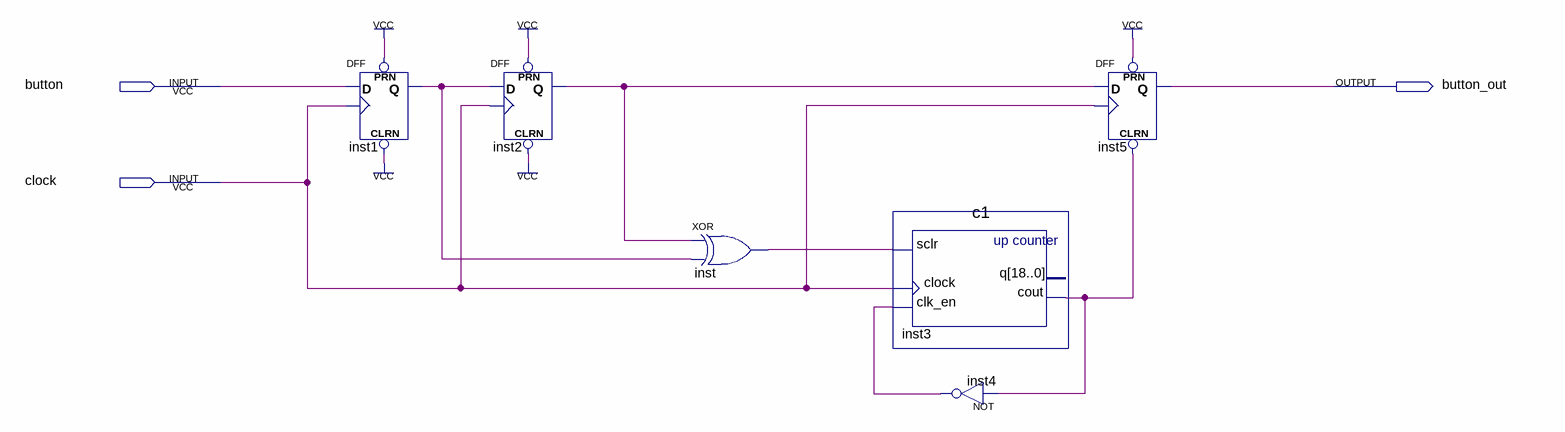
[diagram p0: schematic sheet]
// Quartus schematic Debouncer.bdf as structural Verilog: 6 symbols, 3 pins
module Debouncer (
  input  button,
  input  clock,
  output button_out
);

  wire inst1_q, inst2_q, inst3_cout, inst4_out, inst_out;

  DFF inst1 (.CLRN(1'b1), .CLK(clock), .D(button), .PRN(1'b1), .Q(inst1_q));
  DFF inst2 (.CLRN(1'b1), .CLK(clock), .D(inst1_q), .PRN(1'b1), .Q(inst2_q));
  xor inst (inst_out, inst2_q, inst1_q);
  c1 inst3 (.sclr(inst_out), .clock(clock), .clk_en(inst4_out), .cout(inst3_cout));  // open: q
  not inst4 (inst4_out, inst3_cout);
  DFF inst5 (.CLRN(inst3_cout), .CLK(clock), .D(inst2_q), .PRN(1'b1), .Q(button_out));
endmodule
